# Altium schematic sheet Panel.SchDoc: Panel 1 - płyta czołowa
size A4; Author: Jakub Wiczyński; Revision: 1
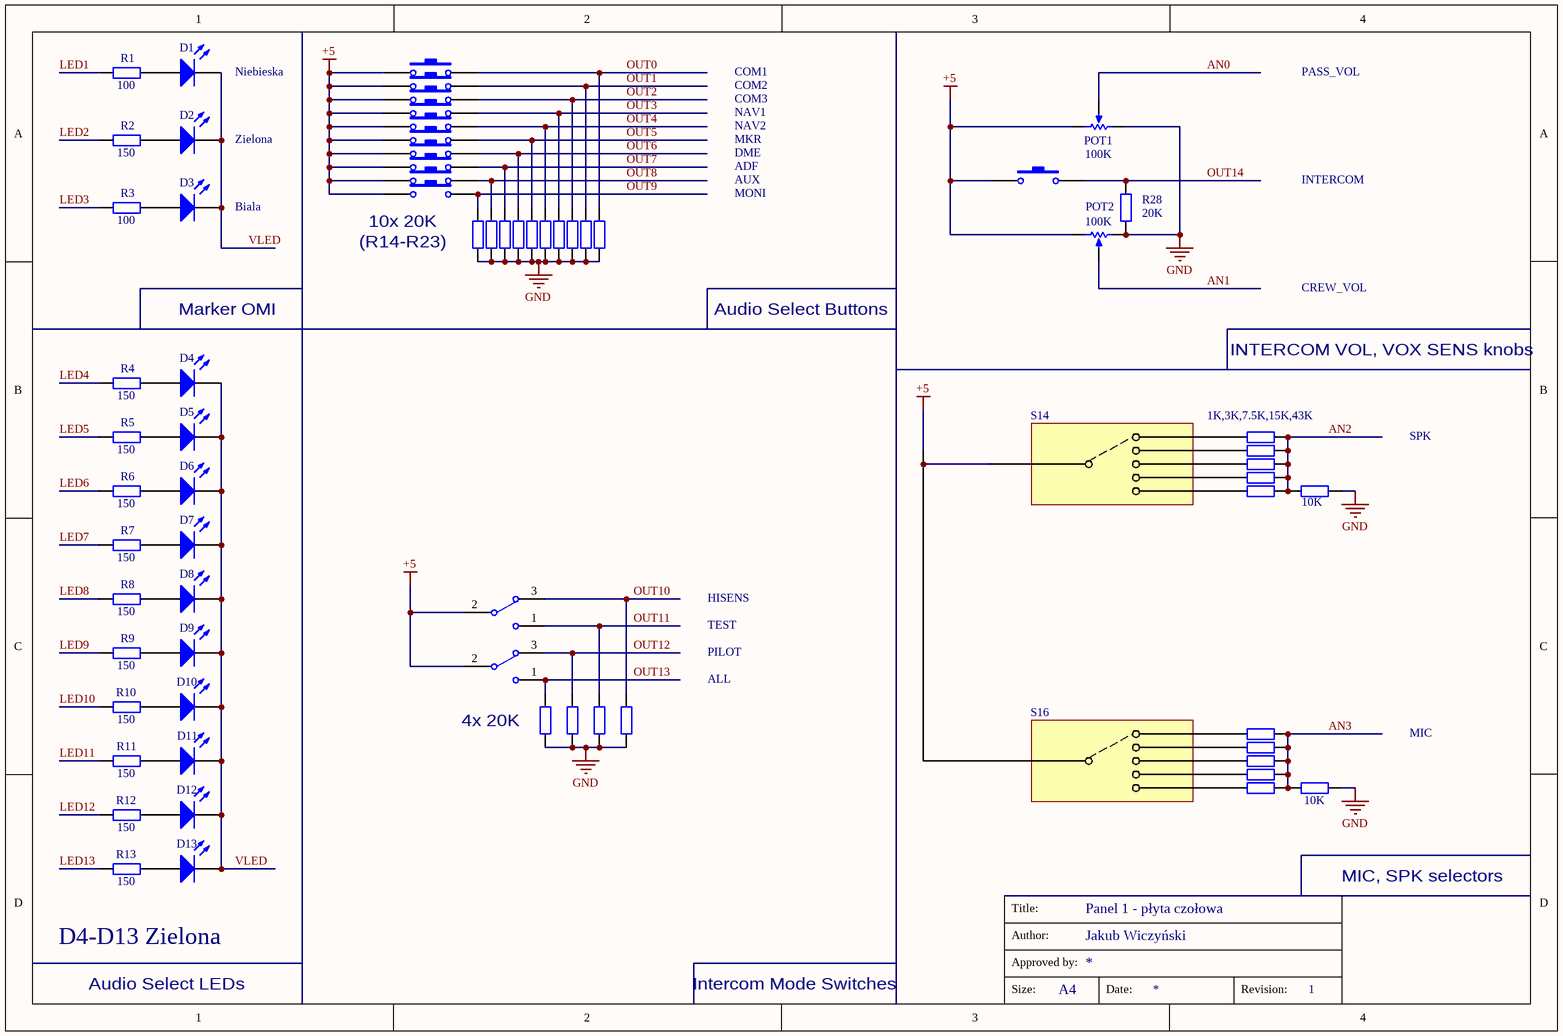
[diagram p0: Panel.SchDoc]

## Parts
D1  http://www.tme.eu/pl/details/of-smd3216b/diody-led-smd-kolorowe/optoflash/  [Dioda SMD 1206 Niebieska]  (value not drawn)
D2  http://www.tme.eu/pl/details/of-smd3216yg-rv/diody-led-smd-kolorowe/optoflash/  [Dioda SMD 1206 Zielona]  (value not drawn)
D3  http://www.tme.eu/pl/details/ltw-150tk/diody-led-smd-biale/liteon/  [Dioda SMD 1206 Biala]  (value not drawn)
D4  http://www.tme.eu/pl/details/of-smd3216yg-rv/diody-led-smd-kolorowe/optoflash/  [Dioda SMD 1206 Zielona]  (value not drawn)
D5  http://www.tme.eu/pl/details/of-smd3216yg-rv/diody-led-smd-kolorowe/optoflash/  [Dioda SMD 1206 Zielona]  (value not drawn)
D6  http://www.tme.eu/pl/details/of-smd3216yg-rv/diody-led-smd-kolorowe/optoflash/  [Dioda SMD 1206 Zielona]  (value not drawn)
D7  http://www.tme.eu/pl/details/of-smd3216yg-rv/diody-led-smd-kolorowe/optoflash/  [Dioda SMD 1206 Zielona]  (value not drawn)
D8  http://www.tme.eu/pl/details/of-smd3216yg-rv/diody-led-smd-kolorowe/optoflash/  [Dioda SMD 1206 Zielona]  (value not drawn)
D9  http://www.tme.eu/pl/details/of-smd3216yg-rv/diody-led-smd-kolorowe/optoflash/  [Dioda SMD 1206 Zielona]  (value not drawn)
D10  http://www.tme.eu/pl/details/of-smd3216yg-rv/diody-led-smd-kolorowe/optoflash/  [Dioda SMD 1206 Zielona]  (value not drawn)
D11  http://www.tme.eu/pl/details/of-smd3216yg-rv/diody-led-smd-kolorowe/optoflash/  [Dioda SMD 1206 Zielona]  (value not drawn)
D12  http://www.tme.eu/pl/details/of-smd3216yg-rv/diody-led-smd-kolorowe/optoflash/  [Dioda SMD 1206 Zielona]  (value not drawn)
D13  http://www.tme.eu/pl/details/of-smd3216yg-rv/diody-led-smd-kolorowe/optoflash/  [Dioda SMD 1206 Zielona]  (value not drawn)
POT1  value 100K  [Potentiometer]  (hidden comment: http://www.tme.eu/pl/details/pcw1j-c24-bab104l/potencjometry-jednoobrz-przew-plastiku/bourns/)
POT2  value 100K  [Potentiometer]  (hidden comment: http://www.tme.eu/pl/details/pcw1j-c24-bab104l/potencjometry-jednoobrz-przew-plastiku/bourns/)
R1  value 100  [C1206]  (hidden comment: http://www.tme.eu/pl/details/crcw1206100rfktabc/rezystory-smd-1206/vishay/)
R2  value 150  [C1206]  (hidden comment: http://www.tme.eu/pl/details/crcw1206150rfktabc/rezystory-smd-1206/vishay/)
R3  value 100  [C1206]  (hidden comment: http://www.tme.eu/pl/details/crcw1206100rfktabc/rezystory-smd-1206/vishay/)
R4  value 150  [C1206]  (hidden comment: http://www.tme.eu/pl/details/crcw1206150rfktabc/rezystory-smd-1206/vishay/)
R5  value 150  [C1206]  (hidden comment: http://www.tme.eu/pl/details/crcw1206150rfktabc/rezystory-smd-1206/vishay/)
R6  value 150  [C1206]  (hidden comment: http://www.tme.eu/pl/details/crcw1206150rfktabc/rezystory-smd-1206/vishay/)
R7  value 150  [C1206]  (hidden comment: http://www.tme.eu/pl/details/crcw1206150rfktabc/rezystory-smd-1206/vishay/)
R8  value 150  [C1206]  (hidden comment: http://www.tme.eu/pl/details/crcw1206150rfktabc/rezystory-smd-1206/vishay/)
R9  value 150  [C1206]  (hidden comment: http://www.tme.eu/pl/details/crcw1206150rfktabc/rezystory-smd-1206/vishay/)
R10  value 150  [C1206]  (hidden comment: http://www.tme.eu/pl/details/crcw1206150rfktabc/rezystory-smd-1206/vishay/)
R11  value 150  [C1206]  (hidden comment: http://www.tme.eu/pl/details/crcw1206150rfktabc/rezystory-smd-1206/vishay/)
R12  value 150  [C1206]  (hidden comment: http://www.tme.eu/pl/details/crcw1206150rfktabc/rezystory-smd-1206/vishay/)
R13  value 150  [C1206]  (hidden comment: http://www.tme.eu/pl/details/crcw1206150rfktabc/rezystory-smd-1206/vishay/)
R14  http://www.tme.eu/pl/details/crcw120620k0fktabc/rezystory-smd-1206/vishay/  [C1206]  (value not drawn)
R15  http://www.tme.eu/pl/details/crcw120620k0fktabc/rezystory-smd-1206/vishay/  [C1206]  (value not drawn)
R16  http://www.tme.eu/pl/details/crcw120620k0fktabc/rezystory-smd-1206/vishay/  [C1206]  (value not drawn)
R17  http://www.tme.eu/pl/details/crcw120620k0fktabc/rezystory-smd-1206/vishay/  [C1206]  (value not drawn)
R18  http://www.tme.eu/pl/details/crcw120620k0fktabc/rezystory-smd-1206/vishay/  [C1206]  (value not drawn)
R19  http://www.tme.eu/pl/details/crcw120620k0fktabc/rezystory-smd-1206/vishay/  [C1206]  (value not drawn)
R20  http://www.tme.eu/pl/details/crcw120620k0fktabc/rezystory-smd-1206/vishay/  [C1206]  (value not drawn)
R21  http://www.tme.eu/pl/details/crcw120620k0fktabc/rezystory-smd-1206/vishay/  [C1206]  (value not drawn)
R22  http://www.tme.eu/pl/details/crcw120620k0fktabc/rezystory-smd-1206/vishay/  [C1206]  (value not drawn)
R23  http://www.tme.eu/pl/details/crcw120620k0fktabc/rezystory-smd-1206/vishay/  [C1206]  (value not drawn)
R24  http://www.tme.eu/pl/details/crcw120620k0fktabc/rezystory-smd-1206/vishay/  [C1206]  (value not drawn)
R25  http://www.tme.eu/pl/details/crcw120620k0fktabc/rezystory-smd-1206/vishay/  [C1206]  (value not drawn)
R26  http://www.tme.eu/pl/details/crcw120620k0fktabc/rezystory-smd-1206/vishay/  [C1206]  (value not drawn)
R27  http://www.tme.eu/pl/details/crcw120620k0fktabc/rezystory-smd-1206/vishay/  [C1206]  (value not drawn)
R28  value 20K  [C1206]  (hidden comment: http://www.tme.eu/pl/details/crcw120620k0fktabc/rezystory-smd-1206/vishay/)
R29  http://www.tme.eu/pl/details/crcw12061k00fkea/rezystory-smd-1206/vishay/  [C1206]  (value not drawn)
R30  http://www.tme.eu/pl/details/crcw12063k00fktabc/rezystory-smd-1206/vishay/  [C1206]  (value not drawn)
R31  http://www.tme.eu/pl/details/crcw12067k50fktabc/rezystory-smd-1206/vishay/  [C1206]  (value not drawn)
R32  http://www.tme.eu/pl/details/crcw120615k0jntabc/rezystory-smd-1206/vishay/  [C1206]  (value not drawn)
R33  http://www.tme.eu/pl/details/rc1206jr-0743k/rezystory-smd-1206/yageo/rc1206jr-0743kl/  [C1206]  (value not drawn)
R34  value 10K  [C1206]  (hidden comment: http://www.tme.eu/pl/details/crcw120610k0jntabc/rezystory-smd-1206/vishay/)
R36  http://www.tme.eu/pl/details/crcw12061k00fkea/rezystory-smd-1206/vishay/  [C1206]  (value not drawn)
R37  http://www.tme.eu/pl/details/crcw12063k00fktabc/rezystory-smd-1206/vishay/  [C1206]  (value not drawn)
R38  http://www.tme.eu/pl/details/crcw12067k50fktabc/rezystory-smd-1206/vishay/  [C1206]  (value not drawn)
R39  http://www.tme.eu/pl/details/crcw120615k0jntabc/rezystory-smd-1206/vishay/  [C1206]  (value not drawn)
R40  http://www.tme.eu/pl/details/rc1206jr-0743k/rezystory-smd-1206/yageo/rc1206jr-0743kl/  [C1206]  (value not drawn)
R41  value 10K  [C1206]  (hidden comment: http://www.tme.eu/pl/details/crcw120610k0jntabc/rezystory-smd-1206/vishay/)
S1  http://www.tme.eu/pl/details/1301.9315/mikroprzelaczniki-tact-pcb/schurter/  [Microswitch_SMD]  (value not drawn)
S2  http://www.tme.eu/pl/details/1301.9315/mikroprzelaczniki-tact-pcb/schurter/  [Microswitch_SMD]  (value not drawn)
S3  http://www.tme.eu/pl/details/1301.9315/mikroprzelaczniki-tact-pcb/schurter/  [Microswitch_SMD]  (value not drawn)
S4  http://www.tme.eu/pl/details/1301.9315/mikroprzelaczniki-tact-pcb/schurter/  [Microswitch_SMD]  (value not drawn)
S5  http://www.tme.eu/pl/details/1301.9315/mikroprzelaczniki-tact-pcb/schurter/  [Microswitch_SMD]  (value not drawn)
S6  http://www.tme.eu/pl/details/1301.9315/mikroprzelaczniki-tact-pcb/schurter/  [Microswitch_SMD]  (value not drawn)
S7  http://www.tme.eu/pl/details/1301.9315/mikroprzelaczniki-tact-pcb/schurter/  [Microswitch_SMD]  (value not drawn)
S8  http://www.tme.eu/pl/details/1301.9315/mikroprzelaczniki-tact-pcb/schurter/  [Microswitch_SMD]  (value not drawn)
S9  http://www.tme.eu/pl/details/1301.9315/mikroprzelaczniki-tact-pcb/schurter/  [Microswitch_SMD]  (value not drawn)
S10  http://www.tme.eu/pl/details/1301.9315/mikroprzelaczniki-tact-pcb/schurter/  [Microswitch_SMD]  (value not drawn)
S11  http://www.tme.eu/pl/details/1ms3t1b1m1qe/przelaczniki-dzwigniowe/ninigi/  [3POS SWITCH]  (value not drawn)
S12  http://www.tme.eu/pl/details/1ms3t1b1m1qe/przelaczniki-dzwigniowe/ninigi/  [3POS SWITCH]  (value not drawn)
S13  http://www.tme.eu/pl/details/1301.9315/mikroprzelaczniki-tact-pcb/schurter/  [Microswitch_SMD]  (value not drawn)
S14  http://www.tme.eu/pl/details/sr2611515fn/przelaczniki-obrotowe/ninigi/  [ROT SW]  (value not drawn)
S16  http://www.tme.eu/pl/details/sr2611515fn/przelaczniki-obrotowe/ninigi/  [ROT SW]  (value not drawn)

## Nets
+5: POT1.2(BOT) POT2.1(TOP) S1.1 S2.1 S3.1 S4.1 S5.1 S6.1 S7.1 S8.1 S9.1 S10.1 S11.2 S12.2 S13.1 S14.1 S16.1
GND: POT1.1(TOP) POT2.2(BOT) R14.1 R15.1 R16.1 R17.1 R18.1 R19.1 R20.1 R21.1 R22.1 R23.1 R24.1 R25.1 R26.1 R27.1 R28.2 R34.1 R41.1
AN0: POT1.3(TAP)
AN1: POT2.3(TAP)
AN2: R29.2 R30.2 R31.2 R32.2 R33.2 R34.2
AN3: R36.2 R37.2 R38.2 R39.2 R40.2 R41.2
LED1: R1.1
LED2: R2.1
LED3: R3.1
LED4: R4.1
LED5: R5.1
LED6: R6.1
LED7: R7.1
LED8: R8.1
LED9: R9.1
LED10: R10.1
LED11: R11.1
LED12: R12.1
LED13: R13.1
OUT0: R23.2 S1.2
OUT1: R22.2 S2.2
OUT2: R21.2 S3.2
OUT3: R20.2 S4.2
OUT4: R19.2 S5.2
OUT5: R18.2 S6.2
OUT6: R17.2 S7.2
OUT7: R16.2 S8.2
OUT8: R15.2 S9.2
OUT9: R14.2 S10.2
OUT10: R27.2 S11.3
OUT11: R26.2 S11.1
OUT12: R25.2 S12.3
OUT13: R24.2 S12.1
OUT14: R28.1 S13.2
VLED: D1.2(K) D2.2(K) D3.2(K) D4.2(K) D5.2(K) D6.2(K) D7.2(K) D8.2(K) D9.2(K) D10.2(K) D11.2(K) D12.2(K) D13.2(K)
NetD1_1: D1.1(A) R1.2
NetD2_1: D2.1(A) R2.2
NetD3_1: D3.1(A) R3.2
NetD4_1: D4.1(A) R4.2
NetD5_1: D5.1(A) R5.2
NetD6_1: D6.1(A) R6.2
NetD7_1: D7.1(A) R7.2
NetD8_1: D8.1(A) R8.2
NetD9_1: D9.1(A) R9.2
NetD10_1: D10.1(A) R10.2
NetD11_1: D11.1(A) R11.2
NetD12_1: D12.1(A) R12.2
NetD13_1: D13.1(A) R13.2
NetR29_1: R29.1 S14.2
NetR30_1: R30.1 S14.3
NetR31_1: R31.1 S14.4
NetR32_1: R32.1 S14.5
NetR33_1: R33.1 S14.6
NetR36_1: R36.1 S16.2
NetR37_1: R37.1 S16.3
NetR38_1: R38.1 S16.4
NetR39_1: R39.1 S16.5
NetR40_1: R40.1 S16.6

## Notes on the sheet
- (near D1) Niebieska
- COM1
- COM2
- COM3
- NAV1
- PASS_VOL
- (near D2) Zielona
- NAV2
- MKR
- DME
- ADF
- (near D3) Biala
- (near S10) 10x 20K
- (R14-R23)
- AUX
- MONI
- INTERCOM
- Marker OMI
- Audio Select Buttons
- CREW_VOL
- INTERCOM VOL, VOX SENS knobs
- 1K,3K,7.5K,15K,43K
- SPK
- HISENS
- TEST
- PILOT
- 4x 20K
- ALL
- MIC
- MIC, SPK selectors
- D4-D13 Zielona
- Audio Select LEDs
- Intercom Mode Switches
- Title:
- Author:
- Approved by:
- Size:
- A4
- Date:
- Revision:

## Library data of the parts
D1 = LED0: LED SMD Niebieska; Published: 8-Jun-2000; LatestRevisionDate: 08-Jul-2005; LatestRevisionNote: Mech Layer 1 removed.; PackageReference: LED-0; Publisher: Altium Limited; PackageDescription: LED; 2 Leads
D2 D4-D13 = LED0: LED SMD Zielona; Published: 8-Jun-2000; LatestRevisionDate: 08-Jul-2005; LatestRevisionNote: Mech Layer 1 removed.; PackageReference: LED-0; Publisher: Altium Limited; PackageDescription: LED; 2 Leads
D3 = LED0: LED SMD Biala; Published: 8-Jun-2000; LatestRevisionDate: 08-Jul-2005; LatestRevisionNote: Mech Layer 1 removed.; PackageReference: LED-0; Publisher: Altium Limited; PackageDescription: LED; 2 Leads
POT1 POT2 = RPot: Potencjometr 100K; pin to pad: 1>3 2>1 3>2; Sim Note: Enter the Resistance value and the set point into parameter fields.; Set Position: 0.5; Published: 8-Jun-2000; LatestRevisionDate: 17-Jul-2002; LatestRevisionNote: Re-released for DXP Platform.; PackageReference: VR5; Publisher: Altium Limited; PackageDescription: Variable Resistor, Thru-Hole; 3 Leads
R1 R3 = Res2: 100R; Published: 8-Jun-2000; LatestRevisionDate: 17-Jul-2002; LatestRevisionNote: Re-released for DXP Platform.; PackageReference: AXIAL-0.4; Publisher: Altium Limited; PackageDescription: Axial Device, Thru-Hole; 2 Leads; 0.4 in Pin Spacing
R2 R4-R13 = Res2: 150R; Published: 8-Jun-2000; LatestRevisionDate: 17-Jul-2002; LatestRevisionNote: Re-released for DXP Platform.; PackageReference: AXIAL-0.4; Publisher: Altium Limited; PackageDescription: Axial Device, Thru-Hole; 2 Leads; 0.4 in Pin Spacing
R14-R28 = Res2: 20K; Published: 8-Jun-2000; LatestRevisionDate: 17-Jul-2002; LatestRevisionNote: Re-released for DXP Platform.; PackageReference: AXIAL-0.4; Publisher: Altium Limited; PackageDescription: Axial Device, Thru-Hole; 2 Leads; 0.4 in Pin Spacing
  R14-R27: Value: 20K
R29 R36 = Res2: 1K; Published: 8-Jun-2000; LatestRevisionDate: 17-Jul-2002; LatestRevisionNote: Re-released for DXP Platform.; PackageReference: AXIAL-0.4; Publisher: Altium Limited; PackageDescription: Axial Device, Thru-Hole; 2 Leads; 0.4 in Pin Spacing; Value: 1K
R30 R37 = Res2: 3K; Published: 8-Jun-2000; LatestRevisionDate: 17-Jul-2002; LatestRevisionNote: Re-released for DXP Platform.; PackageReference: AXIAL-0.4; Publisher: Altium Limited; PackageDescription: Axial Device, Thru-Hole; 2 Leads; 0.4 in Pin Spacing; Value: 3K
R31 R38 = Res2: 7.5K; Published: 8-Jun-2000; LatestRevisionDate: 17-Jul-2002; LatestRevisionNote: Re-released for DXP Platform.; PackageReference: AXIAL-0.4; Publisher: Altium Limited; PackageDescription: Axial Device, Thru-Hole; 2 Leads; 0.4 in Pin Spacing; Value: 7.5K
R32 R39 = Res2: 15K; Published: 8-Jun-2000; LatestRevisionDate: 17-Jul-2002; LatestRevisionNote: Re-released for DXP Platform.; PackageReference: AXIAL-0.4; Publisher: Altium Limited; PackageDescription: Axial Device, Thru-Hole; 2 Leads; 0.4 in Pin Spacing; Value: 15K
R33 R40 = Res2: 43K; Published: 8-Jun-2000; LatestRevisionDate: 17-Jul-2002; LatestRevisionNote: Re-released for DXP Platform.; PackageReference: AXIAL-0.4; Publisher: Altium Limited; PackageDescription: Axial Device, Thru-Hole; 2 Leads; 0.4 in Pin Spacing; Value: 43K
R34 R41 = Res2: 10K; Published: 8-Jun-2000; LatestRevisionDate: 17-Jul-2002; LatestRevisionNote: Re-released for DXP Platform.; PackageReference: AXIAL-0.4; Publisher: Altium Limited; PackageDescription: Axial Device, Thru-Hole; 2 Leads; 0.4 in Pin Spacing
S1-S10 S13 = SW-PB: Microswitch (SPST); pin to pad: 2>3; Published: 24-Mar-1999; LatestRevisionDate: 17-Jul-2002; LatestRevisionNote: Re-released for DXP Platform.; PackageReference: SPST-2; Publisher: Altium Limited; PackageDescription: Switch; 2 Leads
S11 S12 = SW-SPDT: Przelacznik SP3T; Published: 24-Mar-1999; LatestRevisionDate: 17-Dec-2003; LatestRevisionNote: Schematic revised, PCB Footprint replaced.; DatasheetVersion: 05-Dec-2000; PackageReference: TL36WW15050; Publisher: Altium Limited; PackageDescription: Switch; 4 Leads; ComponentLink1Description: Manufacturer Link; ComponentLink1URL: http://www.apem.com
S14 S16 = 5SW: Przelacznik obrotowy 5-pozycyjny; pin to pad: 1>A 2>1 3>2 4>3 5>4 6>5